# EAGLE schematic interfon (EAGLE 9.6.2)
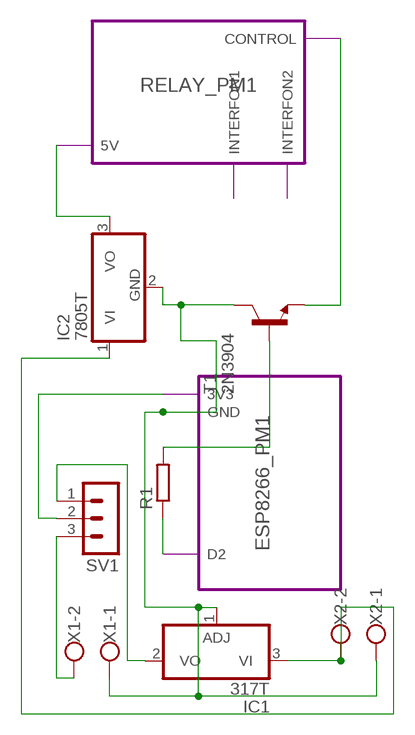
[diagram p0: schematic, sheet 1]

## Parts
IC1  317T  [TO220H]
IC2  7805T  [TO220H]
R1  R-EU_0204/5  [0204/5]
SV1  MA03-1  [MA03-1]
T1  2N3904  [TO92]
X1  W237-102  [W237-102]
X2  W237-102  [W237-102]

## Module instances
ESP8266_PM1 = ESP8266_PM
RELAY_PM1 = RELAY_PM

## Nets
N$1: IC2.3(VO) ; port RELAY_PM1.5V
N$2: T1.3(E) ; port RELAY_PM1.CONTROL
N$3: R1.2 T1.2(B)
N$4: R1.1 ; port ESP8266_PM1.D2
N$5: IC1.3(VI) IC2.1(VI) X2.2
N$6: IC1.1(ADJ) IC2.2(GND) T1.1(C) X1.1 X2.1 ; port ESP8266_PM1.GND
N$7: IC1.2(VO) SV1.1
N$9: SV1.3 X1.2
N$10: SV1.2 ; port ESP8266_PM1.3V3

## Notes on the sheet
- 5V
- 5+V
- 3V | 5+V
- 3V | 5+V

## Library data of the parts
IC1 = linear:*317: Positive VOLTAGE REGULATOR
IC2 = linear:78*: Positive VOLTAGE REGULATOR Source: http://cache.national.com/ds/LM/LM78L05.pdf http://www.fairchildsemi.com/ds/LM/LM7805.pdf
R1 = rcl:R-EU_: RESISTOR, European symbol; SPICEPREFIX: R
SV1 = con-lstb:MA03-1: PIN HEADER; OC_FARNELL: unknown; OC_NEWARK: unknown
T1 = transistor:2N3904: NPN TRANSISTOR
X1 X2 = con-wago-500:W237-102: WAGO SCREW CLAMP; MPN: 237-102; OC_FARNELL: unknown; OC_NEWARK: 70K9898

## Module ESP8266_PM
Ports: D2(io) 3V3(io) GND(io)

### Library data of the parts

## Module RELAY_PM
Ports: 5V(io) INTERFON1(io) INTERFON2(io) CONTROL(io)

### Library data of the parts